# EAGLE design button_brick (EAGLE 7.2.0)
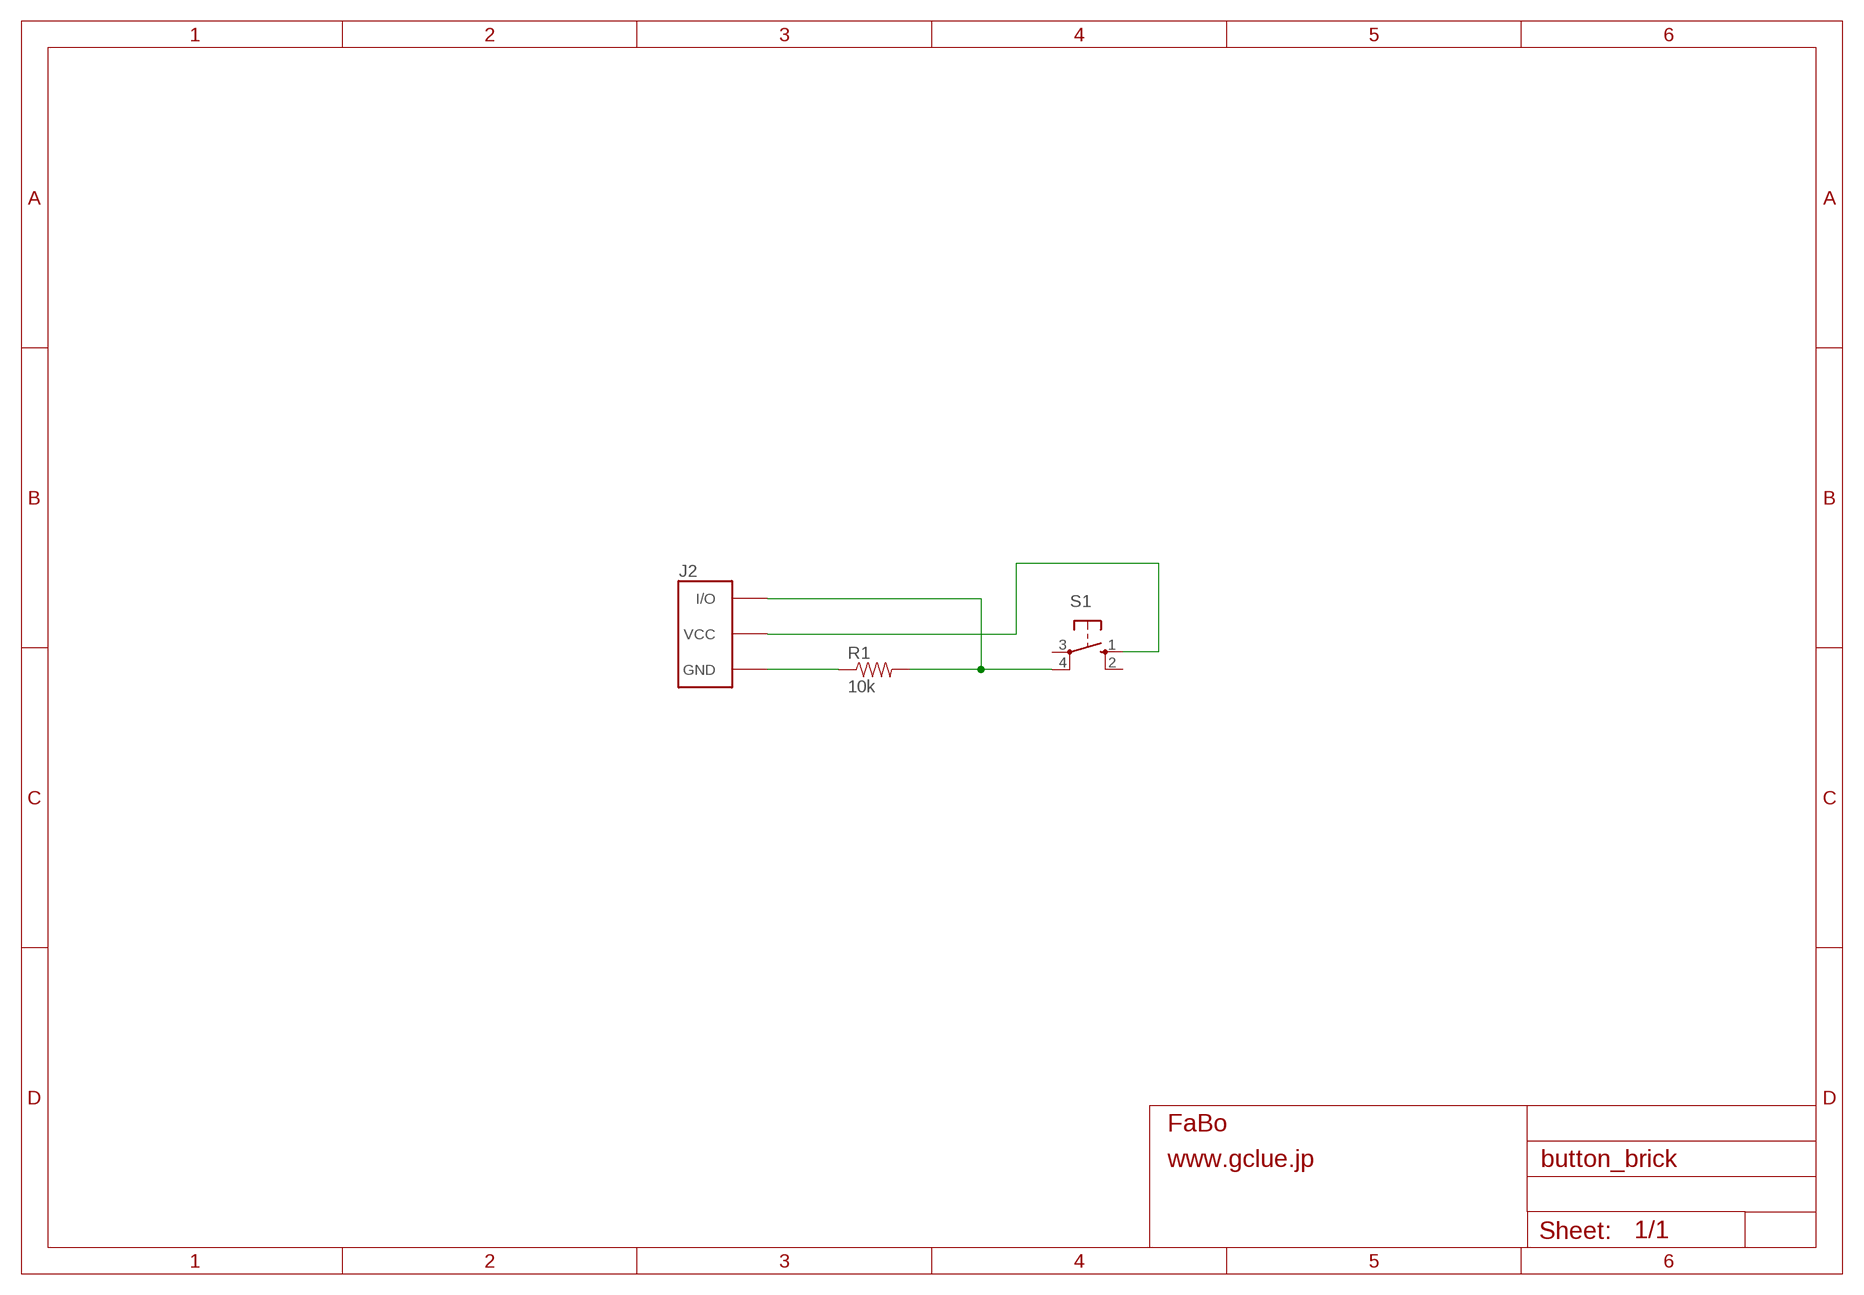
[diagram p0: schematic, sheet 1]

## Parts
J2  BRICK_3PIN  [BRICK_3PIN]
R1  10k  RESISTORPTH-1/4W  [AXIAL-0.4]
S1  Button  10-XX  [B3F-10XX]

## Nets
GND: J2.GND R1.P$1
N$1: J2.VCC S1.1(S)
N$4: J2.IN/OUT(I/O) R1.P$2 S1.4(P1)
Unconnected: S1.2(S1) S1.3(P)

## Library data of the parts
J2 = gclue:BRICK_3PIN: FaBo Brick 3pin
R1 = SparkFun-Resistors:RESISTOR: Resistor Basic schematic elements and footprints for 0603, 1206, and PTH resistors.
S1 = switch-omron:10-XX: OMRON SWITCH; MPN: B3F-1000; OC_FARNELL: 176432; OC_NEWARK: 36M3542

## Board
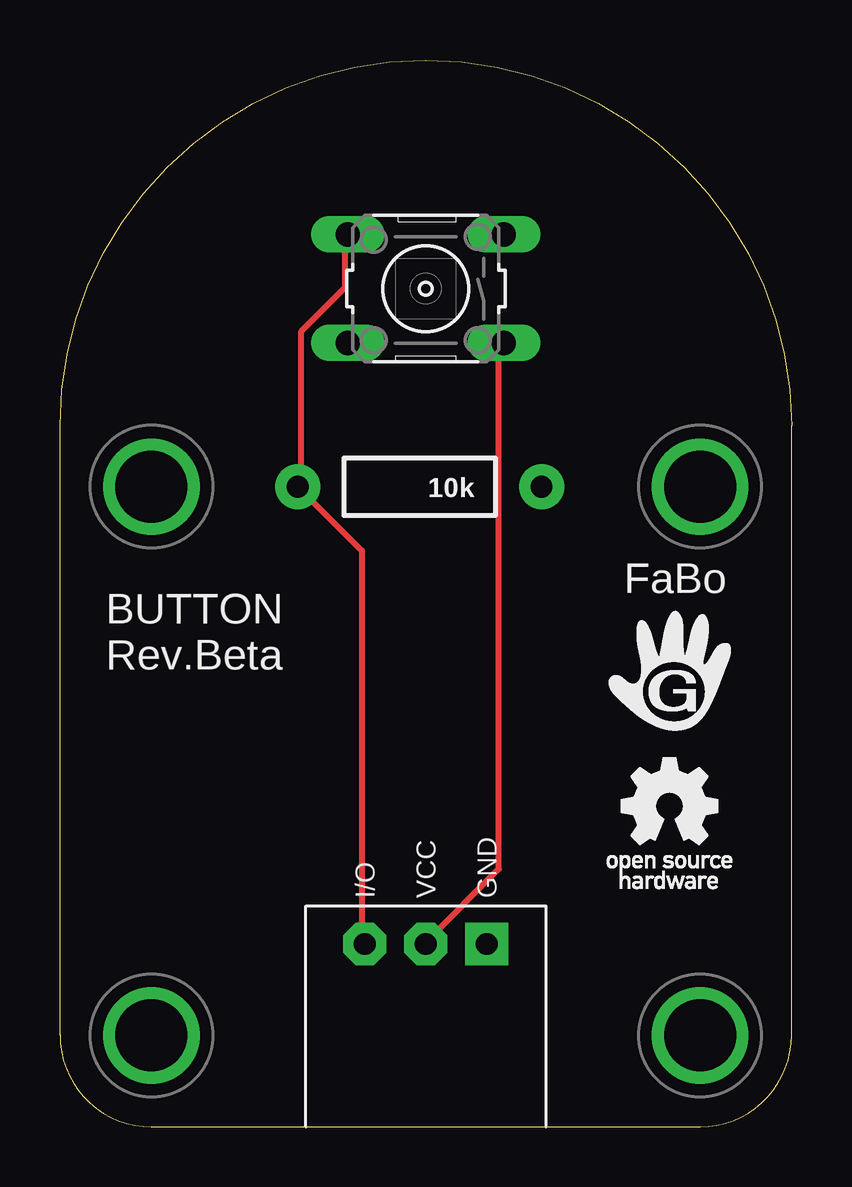
[diagram p1: board, top side]
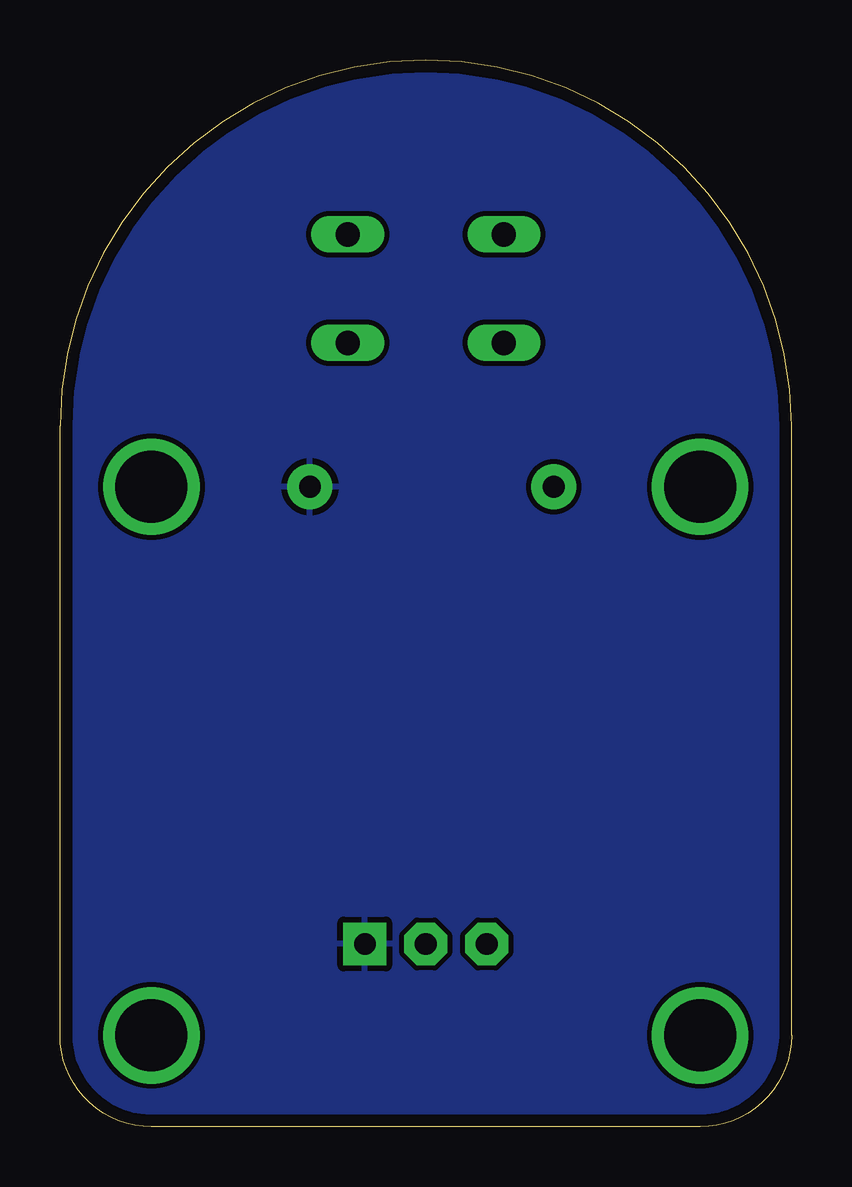
[diagram p2: board, bottom side, seen from below]

Size 30.48 x 44.45 mm. Coordinates in mm from the lower left corner, seen from the top.
Copper layers (1*16): Top 0.035mm / dielectric 1.5mm / Bottom 0.035mm
Design rules "default *": minimum track width 10mil, minimum drill 24mil, track to track 8mil, track to pad 8mil, pad to pad 8mil, via to via 8mil, smd to smd 8mil, copper to edge 20mil, drill to drill 8mil, minimum pad ring 10mil, minimum via ring 8mil, stop-mask expansion 4mil, vias tented up to drill 0mil, thermal gap 10mil

### Footprints (pad centres in the part's own frame; a part is rotated, then mirrored left to right if it is on the bottom)
BRICK_3PIN = drill 0.9 pad 1.778 square: GND 2.54,-11.43 | drill 0.9 pad 1.778 octagon: IN/OUT -2.54,-11.43; VCC 0,-11.43 | drill 3 pad 3.81: P$1 -11.43,7.62; P$2 11.43,7.62; P$3 11.43,-15.24; P$4 -11.43,-15.24
AXIAL-0.4 = drill 0.9 pad 1.88: P$1 -5.08,0; P$2 5.08,0
B3F-10XX = drill 1.016 long: 1 -3.251,2.261; 2 3.251,2.261; 3 -3.251,-2.261; 4 3.251,-2.261

### Placement (x,y rotation side)
J2  15.24,19.05 0 top
R1  14.99,26.67 180 top
S1  15.24,34.92 180 top
U$2  [LOGO_OSHW_T_M]  25.4,13.34 0 top
U$3  [LOGO_GCLUE_M]  25.4,19.05 0 top

### Tracks (layer width: path | path; a pad name or v marks a point on that pad's centre or on a via)
GND
  pour Bottom: 0,0 30.48,0 30.48,44.45 0,44.45
N$1
  Top 0.254: S1.1 18.29,32.46 18.29,10.74 15.32,7.77 J2.VCC
N$4
  Top 0.254: S1.4 11.89,37.03 11.89,34.98 10.06,33.15 10.06,26.75 R1.P$2 12.57,24 12.57,7.77 J2.IN/OUT

### Text on the board
tPlace: FaBo | BUTTON / Rev.Beta